# EAGLE design UM V2 ItsyBitsy (EAGLE 9.6.2)
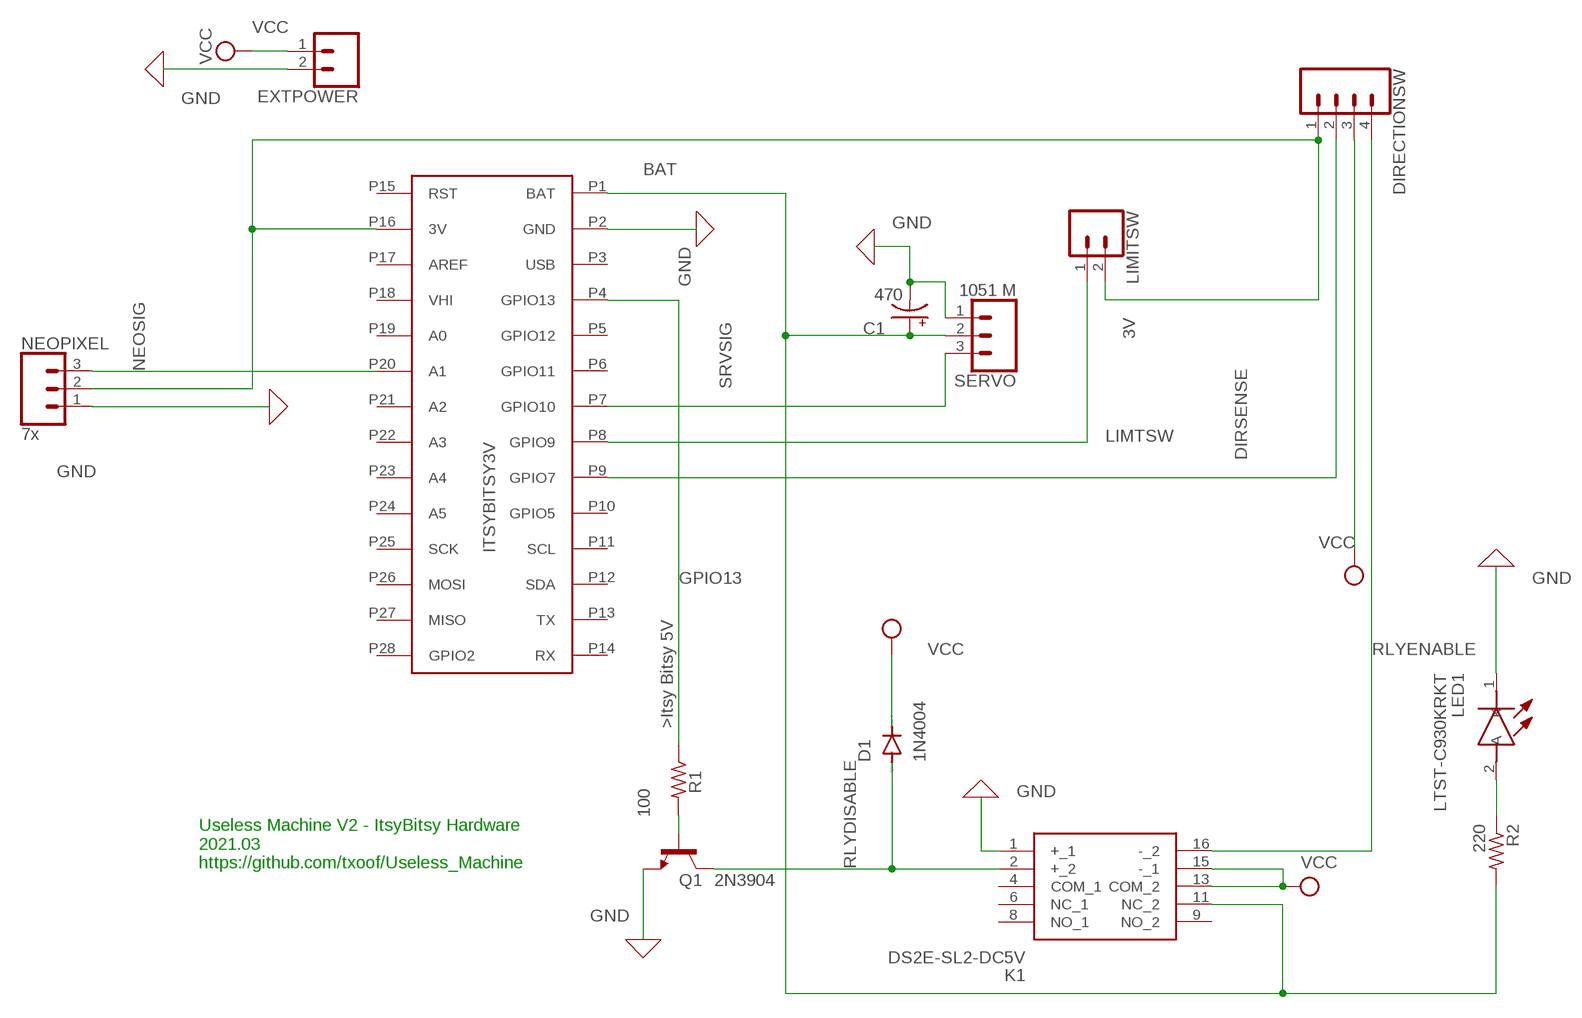
[diagram p0: schematic, sheet 1]

## Parts
C1  470  CPOL-USE2,5-6E  [E2,5-6E]
D1  1N4004  [DO41-10]
DIRECTIONSW  Direction Sw  CONN_04POLAR  [MOLEX-1X4]
EXTPOWER  Limit Sw  CONN_02POLAR  [MOLEX-1X2]
K1  DS2E-SL2-DC5V  [DS2ESL2DC5V]
LED1  LTST-C930KRKT  [LTSTC930KRKT]
LIMITSW  Limit Sw  CONN_02POLAR  [MOLEX-1X2]
NEOPIXEL  7x  CONN_03POLAR  [MOLEX-1X3]
Q1  2N3904  MPS2222A-NPN-TO92-CBE  [TO92-CBE]
R1  100  R-US_M1206  [M1206]
R2  220  R-US_M1206  [M1206]
SERVO  1051 M  CONN_03POLAR  [MOLEX-1X3]
U$1  ITSYBITSY3V  [ITSYBITSY3V]

## Nets
3V [power]: DIRECTIONSW.1 LIMITSW.2 NEOPIXEL.2 U$1.P16(3V)
BAT [power]: C1.+ K1.11(NC_2) R2.2 SERVO.2 U$1.P1(BAT)
DIRSENSE: DIRECTIONSW.2 U$1.P9(GPIO7)
GND [power]: C1.- EXTPOWER.2 K1.1(+_1) LED1.1(K) NEOPIXEL.1 Q1.E SERVO.1 U$1.P2(GND)
GPIO13: R1.1 U$1.P4(GPIO13)
LIMTSW: LIMITSW.1 U$1.P8(GPIO9)
N$1: LED1.2(A) R2.1
N$2: Q1.B R1.2
NEOSIG: NEOPIXEL.3 U$1.P20(A1)
RLYDISABLE [power]: D1.A K1.2(+_2) Q1.C
RLYENABLE [power]: DIRECTIONSW.4 K1.16(-_2)
SRVSIG: SERVO.3 U$1.P7(GPIO10)
VCC [power]: D1.C DIRECTIONSW.3 EXTPOWER.1 K1.13(COM_2) K1.15(-_1)
Unconnected: K1.4(COM_1) K1.6(NC_1) K1.8(NO_1) K1.9(NO_2) U$1.P3(USB) U$1.P5(GPIO12) U$1.P6(GPIO11) U$1.P10(GPIO5) U$1.P11(SCL) U$1.P12(SDA) U$1.P13(TX) U$1.P14(RX) U$1.P15(RST) U$1.P17(AREF) U$1.P18(VHI) U$1.P19(A0) U$1.P21(A2) U$1.P22(A3) U$1.P23(A4) U$1.P24(A5) U$1.P25(SCK) U$1.P26(MOSI) U$1.P27(MISO) U$1.P28(GPIO2)

## Notes on the sheet
- Useless Machine V2 - ItsyBitsy Hardware
  2021.03
  https://github.com/txoof/Useless_Machine

## Library data of the parts
C1 = rcl:CPOL-US: POLARIZED CAPACITOR, American symbol; SPICEPREFIX: C
D1 = diode:1N4004: DIODE general purpose rectifier, 1 A
DIRECTIONSW = SparkFun-Connectors:CONN_04: Multi connection point. Often used as Generic Header-pin footprint for 0.1 inch spaced/style header connections On any of the 0.1 inch spaced packages, you can populate with these: Break Away Headers - Straight <https://www.sparkfun.com/products/116> (PRT-00116) Break Away Male Headers - Right Angle <https://www.sparkfun.com/products/553> (PRT-00553) Female Headers <https://www.sparkfun.com/products/115> (PRT-00115) Break Away Headers - Machine Pin <https://www.sparkfun.com/products/117> (PRT-00117) Break Away Female Headers - Swiss Machine Pin <https://www.sparkfun.com/products/743> (PRT-00743) For SCREWTERMINALS and SPRING TERMINALS visit here: Screw Terimnals on SparkFun.com <https://www.sparkfun.com/search/results?term=Screw+Terminals> (5mm/3.5mm/2.54mm spacing) This device is also useful as a general connection point to wire up your design to another part of your project. Our various solder wires solder well into these plated through hole pads. Hook-Up Wire - Assortment (Stranded, 22 AWG) <https://www.sparkfun.com/products/11375> (PRT-11375) Hook-Up Wire - Assortment (Solid Core, 22 AWG) <https://www.sparkfun.com/products/11367> (PRT-11367) View the entire wire category on our website here <https://www.sparkfun.com/categories/141> Special notes: Molex polarized connector foot print use with SKU : PRT-08231 with associated crimp pins and housings. 1MM SMD Version SKU: PRT-10208; PROD_ID: CONN-08186; SF_ID: PRT-08231
EXTPOWER LIMITSW = SparkFun-Connectors:CONN_02: Multi connection point. Often used as Generic Header-pin footprint for 0.1 inch spaced/style header connections On any of the 0.1 inch spaced packages, you can populate with these: Break Away Headers - Straight <https://www.sparkfun.com/products/116> (PRT-00116) Break Away Male Headers - Right Angle <https://www.sparkfun.com/products/553> (PRT-00553) Female Headers <https://www.sparkfun.com/products/115> (PRT-00115) Break Away Headers - Machine Pin <https://www.sparkfun.com/products/117> (PRT-00117) Break Away Female Headers - Swiss Machine Pin <https://www.sparkfun.com/products/743> (PRT-00743) For SCREWTERMINALS and SPRING TERMINALS visit here: Screw Terimnals on SparkFun.com <https://www.sparkfun.com/search/results?term=Screw+Terminals> (5mm/3.5mm/2.54mm spacing) This device is also useful as a general connection point to wire up your design to another part of your project. Our various solder wires solder well into these plated through hole pads. Hook-Up Wire - Assortment (Stranded, 22 AWG) <https://www.sparkfun.com/products/11375> (PRT-11375) Hook-Up Wire - Assortment (Solid Core, 22 AWG) <https://www.sparkfun.com/products/11367> (PRT-11367) View the entire wire category on our website here <https://www.sparkfun.com/categories/141> Special notes: Molex polarized connector foot print use with: PRT-08233 with associated crimp pins and housings. 2.54_SCREWTERM for use with PRT-10571. 3.5mm Screw Terminal footprints for PRT-08084 5mm Screw Terminal footprints for use with PRT-08432; SF_ID: PRT-09918
K1 = DS2E-SL2-DC5V:DS2E-SL2-DC5V: Low Signal Relays - PCB 2A 5VDC DPDT LATCHING PCB Source: Datasheet <https://componentsearchengine.com/Datasheets/2/DS2E-SL2-DC5V.pdf>; ALLIED_NUMBER: 70158678; DESCRIPTION: Low Signal Relays - PCB 2A 5VDC DPDT LATCHING PCB; HEIGHT: 10.2mm; MANUFACTURER_NAME: Panasonic; MANUFACTURER_PART_NUMBER: DS2E-SL2-DC5V
LED1 = Samac Populated:LTST-C930KRKT: LED, Red LTST-C930KRKT, Lite-On 631 nm 3125 (1210) SMD package Source: Datasheet <http://optoelectronics.liteon.com/upload/download/DS22-2000-094/LTST-C930KRKT.pdf>; DESCRIPTION: LED, Red LTST-C930KRKT, Lite-On 631 nm 3125 (1210) SMD package; HEIGHT: 2.5mm; MANUFACTURER_NAME: Lite-On; MANUFACTURER_PART_NUMBER: LTST-C930KRKT; MOUSER_PART_NUMBER: 859-LTST-C930KRKT; MOUSER_PRICE-STOCK: https://www.mouser.com/Search/Refine.aspx?Keyword=859-LTST-C930KRKT; RS_PART_NUMBER: 1689768; RS_PRICE-STOCK: http://uk.rs-online.com/web/p/products/1689768
NEOPIXEL SERVO = SparkFun-Connectors:CONN_03: Multi connection point. Often used as Generic Header-pin footprint for 0.1 inch spaced/style header connections On any of the 0.1 inch spaced packages, you can populate with these: Break Away Headers - Straight <https://www.sparkfun.com/products/116> (PRT-00116) Break Away Male Headers - Right Angle <https://www.sparkfun.com/products/553> (PRT-00553) Female Headers <https://www.sparkfun.com/products/115> (PRT-00115) Break Away Headers - Machine Pin <https://www.sparkfun.com/products/117> (PRT-00117) Break Away Female Headers - Swiss Machine Pin <https://www.sparkfun.com/products/743> (PRT-00743) Stackable Header - 3 Pin (Female, 0.1") <https://www.sparkfun.com/products/13875> (PRT-13875) For SCREWTERMINALS and SPRING TERMINALS visit here: Screw Terimnals on SparkFun.com <https://www.sparkfun.com/search/results?term=Screw+Terminals> (5mm/3.5mm/2.54mm spacing) This device is also useful as a general connection point to wire up your design to another part of your project. Our various solder wires solder well into these plated through hole pads. Hook-Up Wire - Assortment (Stranded, 22 AWG) <https://www.sparkfun.com/products/11375> (PRT-11375) Hook-Up Wire - Assortment (Solid Core, 22 AWG) <https://www.sparkfun.com/products/11367> (PRT-11367) View the entire wire category on our website here <https://www.sparkfun.com/categories/141> Special notes: Molex polarized connector foot print use with SKU : PRT-08232 with associated crimp pins and housings.; PROD_ID: CONN-08625; SF_ID: PRT-08096
Q1 = transistor:*-NPN-: NPN Transistror BF959 corrected 2008.03.06
R1 R2 = rcl:R-US_: RESISTOR, American symbol; SPICEPREFIX: R
U$1 = custom_parts_txoof:ITSYBITSY3V: AdaFruit ItsyBitsy M4 3V <https://learn.adafruit.com/introducing-adafruit-itsybitsy-m4>

## Net classes
0 default: width 0.254 mm
1 power: width 0.406 mm

## Board
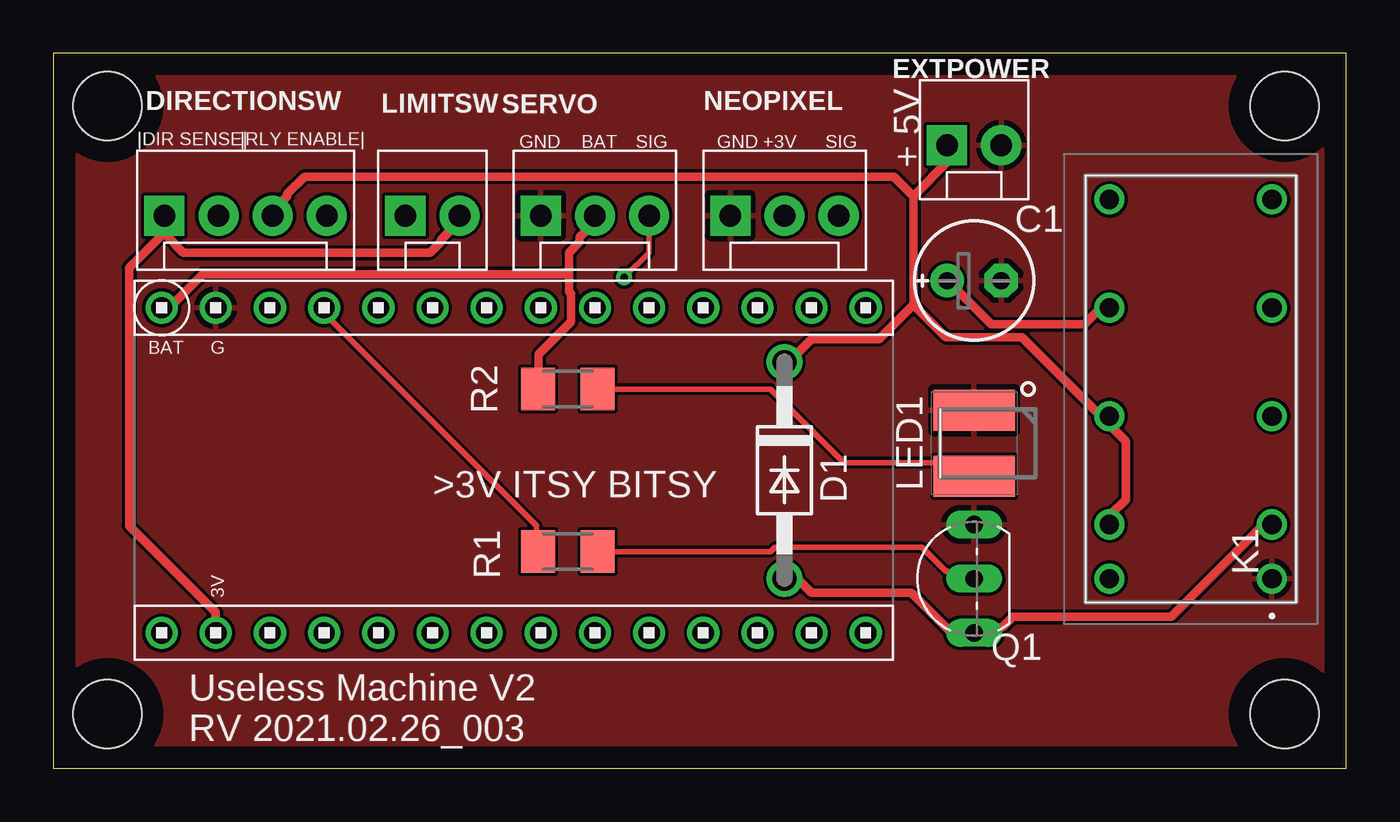
[diagram p1: board, top side]
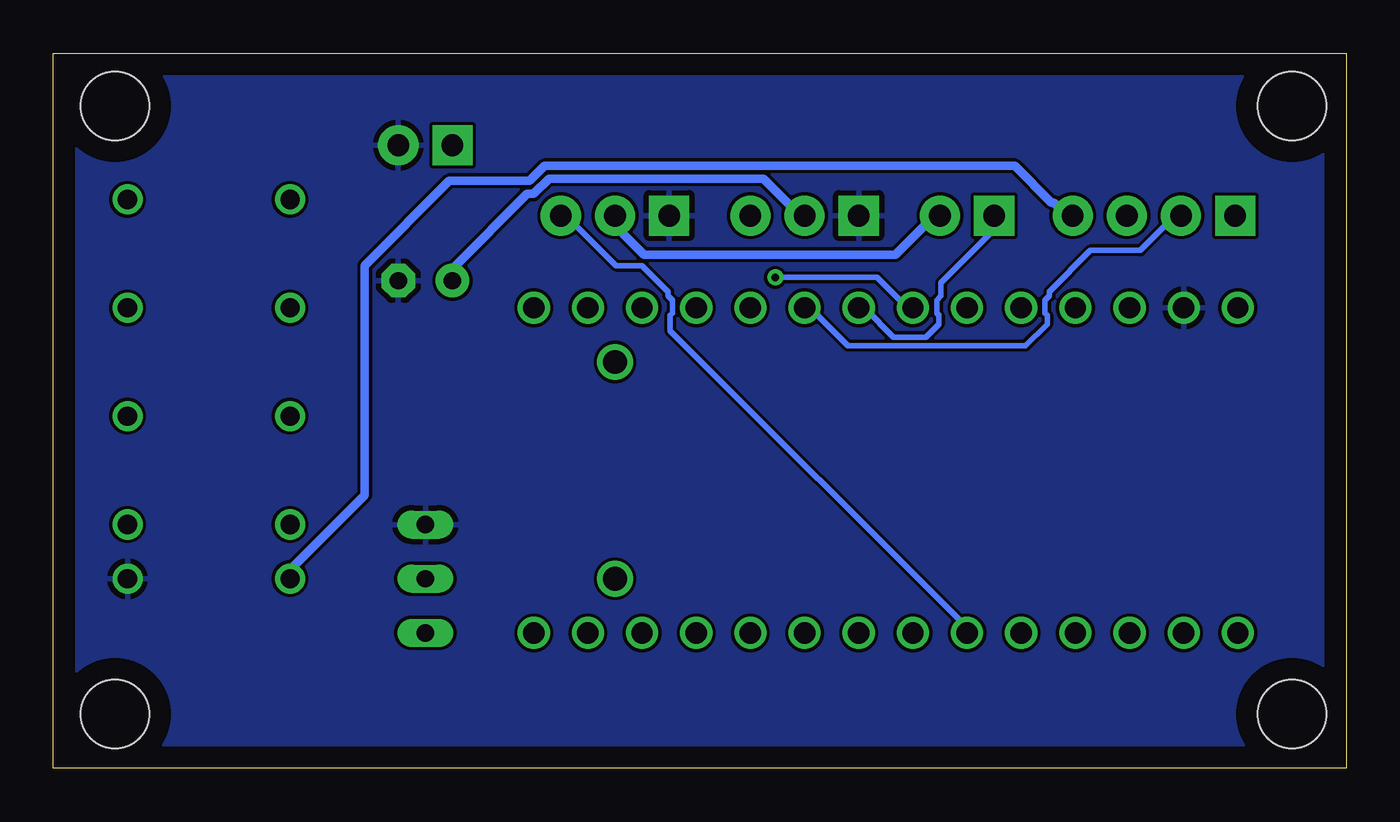
[diagram p2: board, bottom side, seen from below]

Size 60.63 x 33.52 mm. Coordinates in mm from the lower left corner, seen from the top.
Outline: 0,0 60.63,0 60.63,33.52 0,33.52 0,0
Copper layers (1*16): Top 0.035mm / dielectric 1.5mm / Bottom 0.035mm
Design rules "default": minimum track width 6mil, minimum drill 0.35mm, track to track 6mil, track to pad 6mil, pad to pad 6mil, via to via 6mil, smd to smd 6mil, copper to edge 40mil, drill to drill 6mil, minimum pad ring 10mil, minimum via ring 8mil, stop-mask expansion 4mil, vias tented up to drill 0mil, thermal gap 10mil
Holes 3.2 mm at 2.54,31.04 57.74,31.04 57.74,2.54 2.54,2.54

### Footprints (pad centres in the part's own frame; a part is rotated, then mirrored left to right if it is on the bottom)
E2,5-6E = drill 0.813 pad 1.575: + -1.27,0 | drill 0.813 pad 1.575 octagon: - 1.27,0
DO41-10 = drill 1.118: A 5.08,0; C -5.08,0
MOLEX-1X4 = drill 1.016 pad 1.88 square: 1 0,0 | drill 1.016 pad 1.88: 2 2.54,0; 3 5.08,0; 4 7.62,0
MOLEX-1X2 = drill 1.016 pad 1.88 square: 1 0,0 | drill 1.016 pad 1.88: 2 2.54,0
DS2ESL2DC5V = drill 0.9 pad 1.4: 1 0,0; 2 -2.54,0; 4 -7.62,0; 6 -12.7,0; 8 -17.78,0; 9 -17.78,-7.62; 11 -12.7,-7.62; 13 -7.62,-7.62; 15 -2.54,-7.62; 16 0,-7.62
LTSTC930KRKT = smd 1.93 x 3.81: 1 -1.55,0; 2 1.55,0
MOLEX-1X3 = drill 1.016 pad 1.88 square: 1 0,0 | drill 1.016 pad 1.88: 2 2.54,0; 3 5.08,0
TO92-CBE = drill 0.813 long: B 0,0; C -2.54,0; E 2.54,0
M1206 = smd 1.6 x 2: 1 -1.4,0; 2 1.4,0
ITSYBITSY3V = drill 1: P1 -16.51,2.54; P2 -13.97,2.54; P3 -11.43,2.54; P4 -8.89,2.54; P5 -6.35,2.54; P6 -3.81,2.54; P7 -1.27,2.54; P8 1.27,2.54; P9 3.81,2.54; P10 6.35,2.54; P11 8.89,2.54; P12 11.43,2.54; P13 13.97,2.54; P14 16.51,2.54; P15 -16.51,-12.7; P16 -13.97,-12.7; P17 -11.43,-12.7; P18 -8.89,-12.7; P19 -6.35,-12.7; P20 -3.81,-12.7; P21 -1.27,-12.7; P22 1.27,-12.7; P23 3.81,-12.7; P24 6.35,-12.7; P25 8.89,-12.7; P26 11.43,-12.7; P27 13.97,-12.7; P28 16.51,-12.7

### Placement (x,y rotation side)
C1  43.18,22.86 0 top
D1  34.29,13.97 270 top
DIRECTIONSW  5.21,25.91 0 top
EXTPOWER  41.91,29.21 0 top
K1  57.15,8.89 270 top
LED1  43.18,15.24 270 top
LIMITSW  16.51,25.91 0 top
NEOPIXEL  31.75,25.91 0 top
Q1  43.18,8.89 90 top
R1  24.13,10.16 0 top
R2  24.13,17.78 180 top
SERVO  22.86,25.91 0 top
U$1  21.59,19.05 0 top

### Tracks (layer width: path | path; a pad name or v marks a point on that pad's centre or on a via)
3V
  Top 0.406: U$1.P16 7.62,7.32 3.56,11.38 3.56,23.47 5.18,25.09 5.18,25.91 DIRECTIONSW.1 5.28,24.99 6.1,24.18 17.68,24.18 18.19,24.69 18.19,24.79 19,25.6 19,25.91 LIMITSW.2
  Bottom 0.406: LIMITSW.2 19.3,25.91 21.13,24.08 32.92,24.08 34.24,25.4 34.24,25.91 NEOPIXEL.2
BAT
  Top 0.406: K1.11 49.48,21.54 49.07,21.54 48.36,20.83 43.99,20.83 41.96,22.86 C1.+ | 24.18,23.16 24.18,24.18 24.69,24.69 24.69,24.89 25.4,25.6 SERVO.2 | 24.18,23.16 24.18,22.35 24.28,22.25 24.28,20.93 22.76,19.41 22.76,17.78 R2.2 | 24.18,23.16 7.01,23.16 5.49,21.64 5.08,21.64 U$1.P1
  Bottom 0.406: SERVO.2 25.6,25.91 27.33,27.64 37.39,27.64 38.1,26.92 38.41,26.92 41.86,23.47 41.86,22.86 C1.+
DIRSENSE
  Bottom 0.254: DIRECTIONSW.2 8.03,25.91 9.65,24.28 11.99,24.28 13.92,22.35 13.92,22.15 14.12,21.95 14.12,21.34 14.02,21.23 14.02,20.83 15.04,19.81 23.37,19.81 25.09,21.54 25.4,21.54 U$1.P9
GND
  pour Top: 0.51,0 60.96,0 60.96,33.53 0.51,33.53
  pour Bottom: 0,33.53 60.96,33.53 60.96,0 0,0
GPIO13
  Top 0.254: U$1.P4 12.7,21.34 22.66,11.38 22.66,10.16 R1.1
LIMTSW
  Bottom 0.254: U$1.P8 22.86,21.54 22.55,21.54 21.23,20.22 19.71,20.22 19.1,20.83 19.1,21.23 19.2,21.34 19.2,21.95 19,22.15 19,22.76 16.56,25.2 16.56,25.91 LIMITSW.1
N$1
  Top 0.254: R2.1 33.63,17.78 37.08,14.33 42.57,14.33 43.18,13.72 LED1.2
N$2
  Top 0.254: R1.2 33.63,10.16 33.83,10.36 40.74,10.36 41.86,9.25 41.96,9.25 42.27,8.94 43.18,8.94 Q1.B
NEOSIG
  Bottom 0.254: U$1.P20 17.78,6.6 31.7,20.52 31.7,21.23 31.6,21.34 31.6,21.95 31.8,22.15 31.8,22.35 33.02,23.57 34.24,23.57 36.58,25.91 NEOPIXEL.3
RLYDISABLE
  Top 0.406: D1.A 34.34,8.84 34.95,8.84 35.56,8.23 40.23,8.23 42.06,6.4 43.18,6.4 Q1.C 43.28,6.5 44.3,6.5 44.4,6.6 44.5,6.6 45.01,7.11 52.43,7.11 56.69,11.38 57.1,11.38 K1.2
RLYENABLE
  Bottom 0.406: DIRECTIONSW.4 13.11,25.91 13.72,26.52 13.82,26.52 15.54,28.25 37.59,28.25 38.3,27.53 42.06,27.53 46.02,23.57 46.02,12.8 49.48,9.35 49.48,8.94 K1.16
SRVSIG  (via drill 0.35)
  Top 0.254: SERVO.3 27.94,24.18 v26.77,23.01
  Bottom 0.254: v26.77,23.01 22,23.01 20.62,21.64 20.32,21.64 U$1.P7
VCC
  Top 0.406: K1.15 49.58,11.48 49.58,11.89 50.29,12.6 50.29,15.34 49.58,16.05 49.58,16.46 K1.13 49.38,16.56 49.07,16.56 45.41,20.22 41.86,20.22 40.34,21.74 | 40.34,21.74 38.71,20.12 35.56,20.12 34.54,19.1 34.34,19.1 D1.C | 40.34,26.82 40.34,21.74 | 40.34,26.82 41.96,28.45 41.96,29.16 EXTPOWER.1 | 40.34,26.82 39.42,27.74 11.79,27.74 10.97,26.92 10.97,26.82 10.36,26.21 10.36,25.91 DIRECTIONSW.3

### Text on the board
tPlace: + 5V | Useless Machine V2 / RV 2021.02.26_003
tNames: |DIR SENSE| | |RLY ENABLE| | GND | BAT | SIG | GND | +3V | SIG